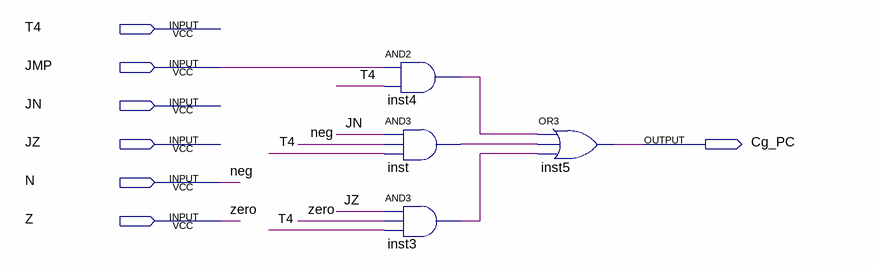
[diagram p0: schematic sheet]
// Quartus schematic abk_carga_pc.bdf as structural Verilog: 4 symbols, 7 pins
module abk_carga_pc (
  input  T4,
  input  JMP,
  input  JN,
  input  JZ,
  input  N,
  input  Z,
  output Cg_PC
);

  wire inst3_out, inst4_out, inst_out;

  and inst4 (inst4_out, JMP, T4);
  and inst (inst_out, JN, N, T4);
  and inst3 (inst3_out, JZ, Z, T4);
  or inst5 (Cg_PC, inst4_out, inst_out, inst3_out);

  // Other names for the same wires on the sheet: neg = N; zero = Z
endmodule
